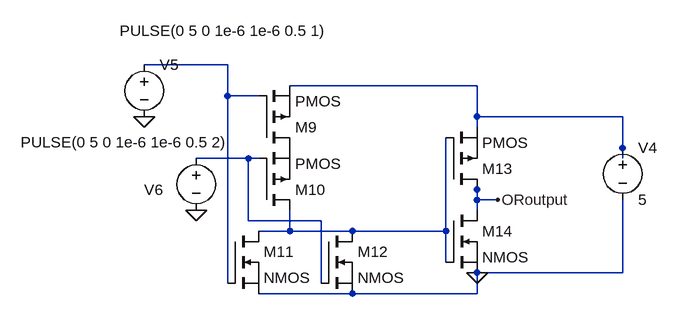
[diagram p0: schematic or.asc]
or.asc, the LTspice schematic file:
Version 4
SHEET 1 2860 680
WIRE 608 -160 480 -160
WIRE 992 -128 704 -128
WIRE 608 -112 608 -160
WIRE 656 -112 608 -112
WIRE 992 -80 992 -128
WIRE 1216 -80 992 -80
WIRE 992 -64 992 -80
WIRE 1216 -32 1216 -80
WIRE 640 -16 560 -16
WIRE 656 -16 640 -16
WIRE 1216 -16 1216 -32
WIRE 992 32 992 16
WIRE 992 48 992 32
WIRE 1024 48 992 48
WIRE 992 64 992 48
WIRE 640 80 640 -16
WIRE 752 80 640 80
WIRE 704 96 704 64
WIRE 704 96 656 96
WIRE 800 96 704 96
WIRE 944 96 944 -48
WIRE 944 96 800 96
WIRE 944 144 944 96
WIRE 1216 160 1216 48
WIRE 1216 160 992 160
WIRE 608 176 608 -112
WIRE 752 176 752 80
WIRE 800 192 656 192
WIRE 992 192 992 160
WIRE 992 192 800 192
FLAG 1024 48 ORoutput
FLAG 992 160 0
FLAG 560 64 0
FLAG 480 -80 0
SYMBOL pmos 656 -32 M180
SYMATTR InstName M9
SYMBOL pmos 656 64 M180
SYMATTR InstName M10
SYMBOL nmos 608 96 R0
SYMATTR InstName M11
SYMBOL nmos 752 96 R0
SYMATTR InstName M12
SYMBOL pmos 944 32 M180
SYMATTR InstName M13
SYMBOL nmos 944 64 R0
SYMATTR InstName M14
SYMBOL voltage 1216 -48 R0
WINDOW 123 0 0 Left 2
WINDOW 39 0 0 Left 2
SYMATTR InstName V4
SYMATTR Value 5
SYMBOL voltage 480 -176 R0
WINDOW 123 0 0 Left 2
WINDOW 39 0 0 Left 2
WINDOW 3 -38 -36 Left 2
SYMATTR Value PULSE(0 5 0 1e-6 1e-6 0.5 1)
SYMATTR InstName V5
SYMBOL voltage 560 -32 R0
WINDOW 123 0 0 Left 2
WINDOW 39 0 0 Left 2
WINDOW 0 -80 64 Left 2
WINDOW 3 -270 -9 Left 2
SYMATTR InstName V6
SYMATTR Value PULSE(0 5 0 1e-6 1e-6 0.5 2)

The netlist it stands for:
* or.asc
M9 P001 N001 N002 N002 PMOS
M10 N004 N003 P001 P001 PMOS
M11 N004 N001 0 0 NMOS
M12 N004 N003 0 0 NMOS
M13 ORoutput N004 N002 N002 PMOS
M14 ORoutput N004 0 0 NMOS
V4 N002 0 5
V5 N001 0 PULSE(0 5 0 1e-6 1e-6 0.5 1)
V6 N003 0 PULSE(0 5 0 1e-6 1e-6 0.5 2)
.model NMOS NMOS
.model PMOS PMOS
.lib standard.mos
.backanno
.end